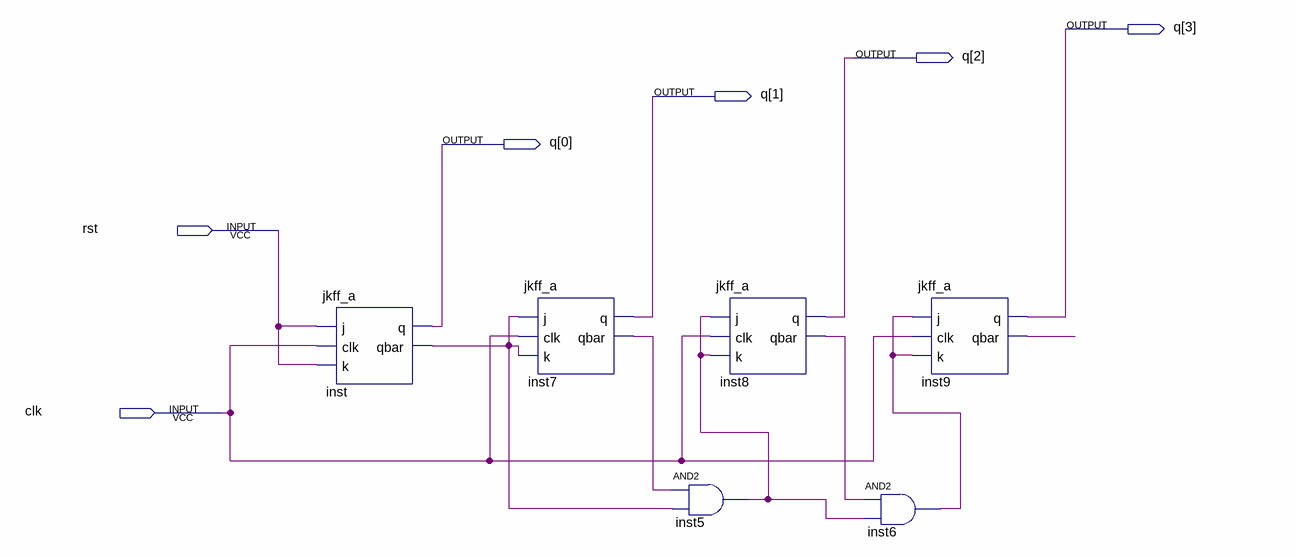
[diagram p0: schematic sheet]
// Quartus schematic down_counter.bdf as structural Verilog: 6 symbols, 6 pins
module down_counter (
  input  rst,
  input  clk,
  output [3:0] q
);

  wire inst5_out, inst6_out, inst7_qbar, inst8_qbar, inst9_qbar, inst_qbar;

  jkff_a inst (.j(rst), .clk(clk), .k(rst), .q(q[0]), .qbar(inst_qbar));
  jkff_a inst7 (.j(inst_qbar), .clk(clk), .k(inst_qbar), .q(q[1]), .qbar(inst7_qbar));
  jkff_a inst8 (.j(inst5_out), .clk(clk), .k(inst5_out), .q(q[2]), .qbar(inst8_qbar));
  and inst5 (inst5_out, inst7_qbar, inst_qbar);
  and inst6 (inst6_out, inst8_qbar, inst5_out);
  jkff_a inst9 (.j(inst6_out), .clk(clk), .k(inst6_out), .q(q[3]), .qbar(inst9_qbar));
endmodule
